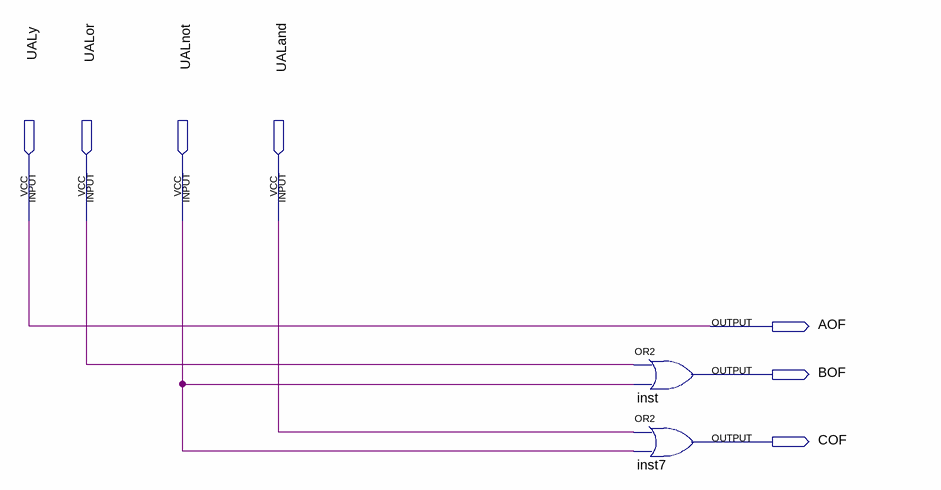
[diagram p0: schematic sheet]
// Quartus schematic decodULA.bdf as structural Verilog: 2 symbols, 7 pins
module decodULA (
  input  UALy,
  input  UALor,
  input  UALnot,
  input  UALand,
  output AOF,
  output BOF,
  output COF
);

  or inst (BOF, UALor, UALnot);
  or inst7 (COF, UALand, UALnot);

  assign AOF = UALy;
endmodule
